# Altium schematic sheet mesh_node.SchDoc
size A3; SheetNumber: 1; SheetTotal: 1
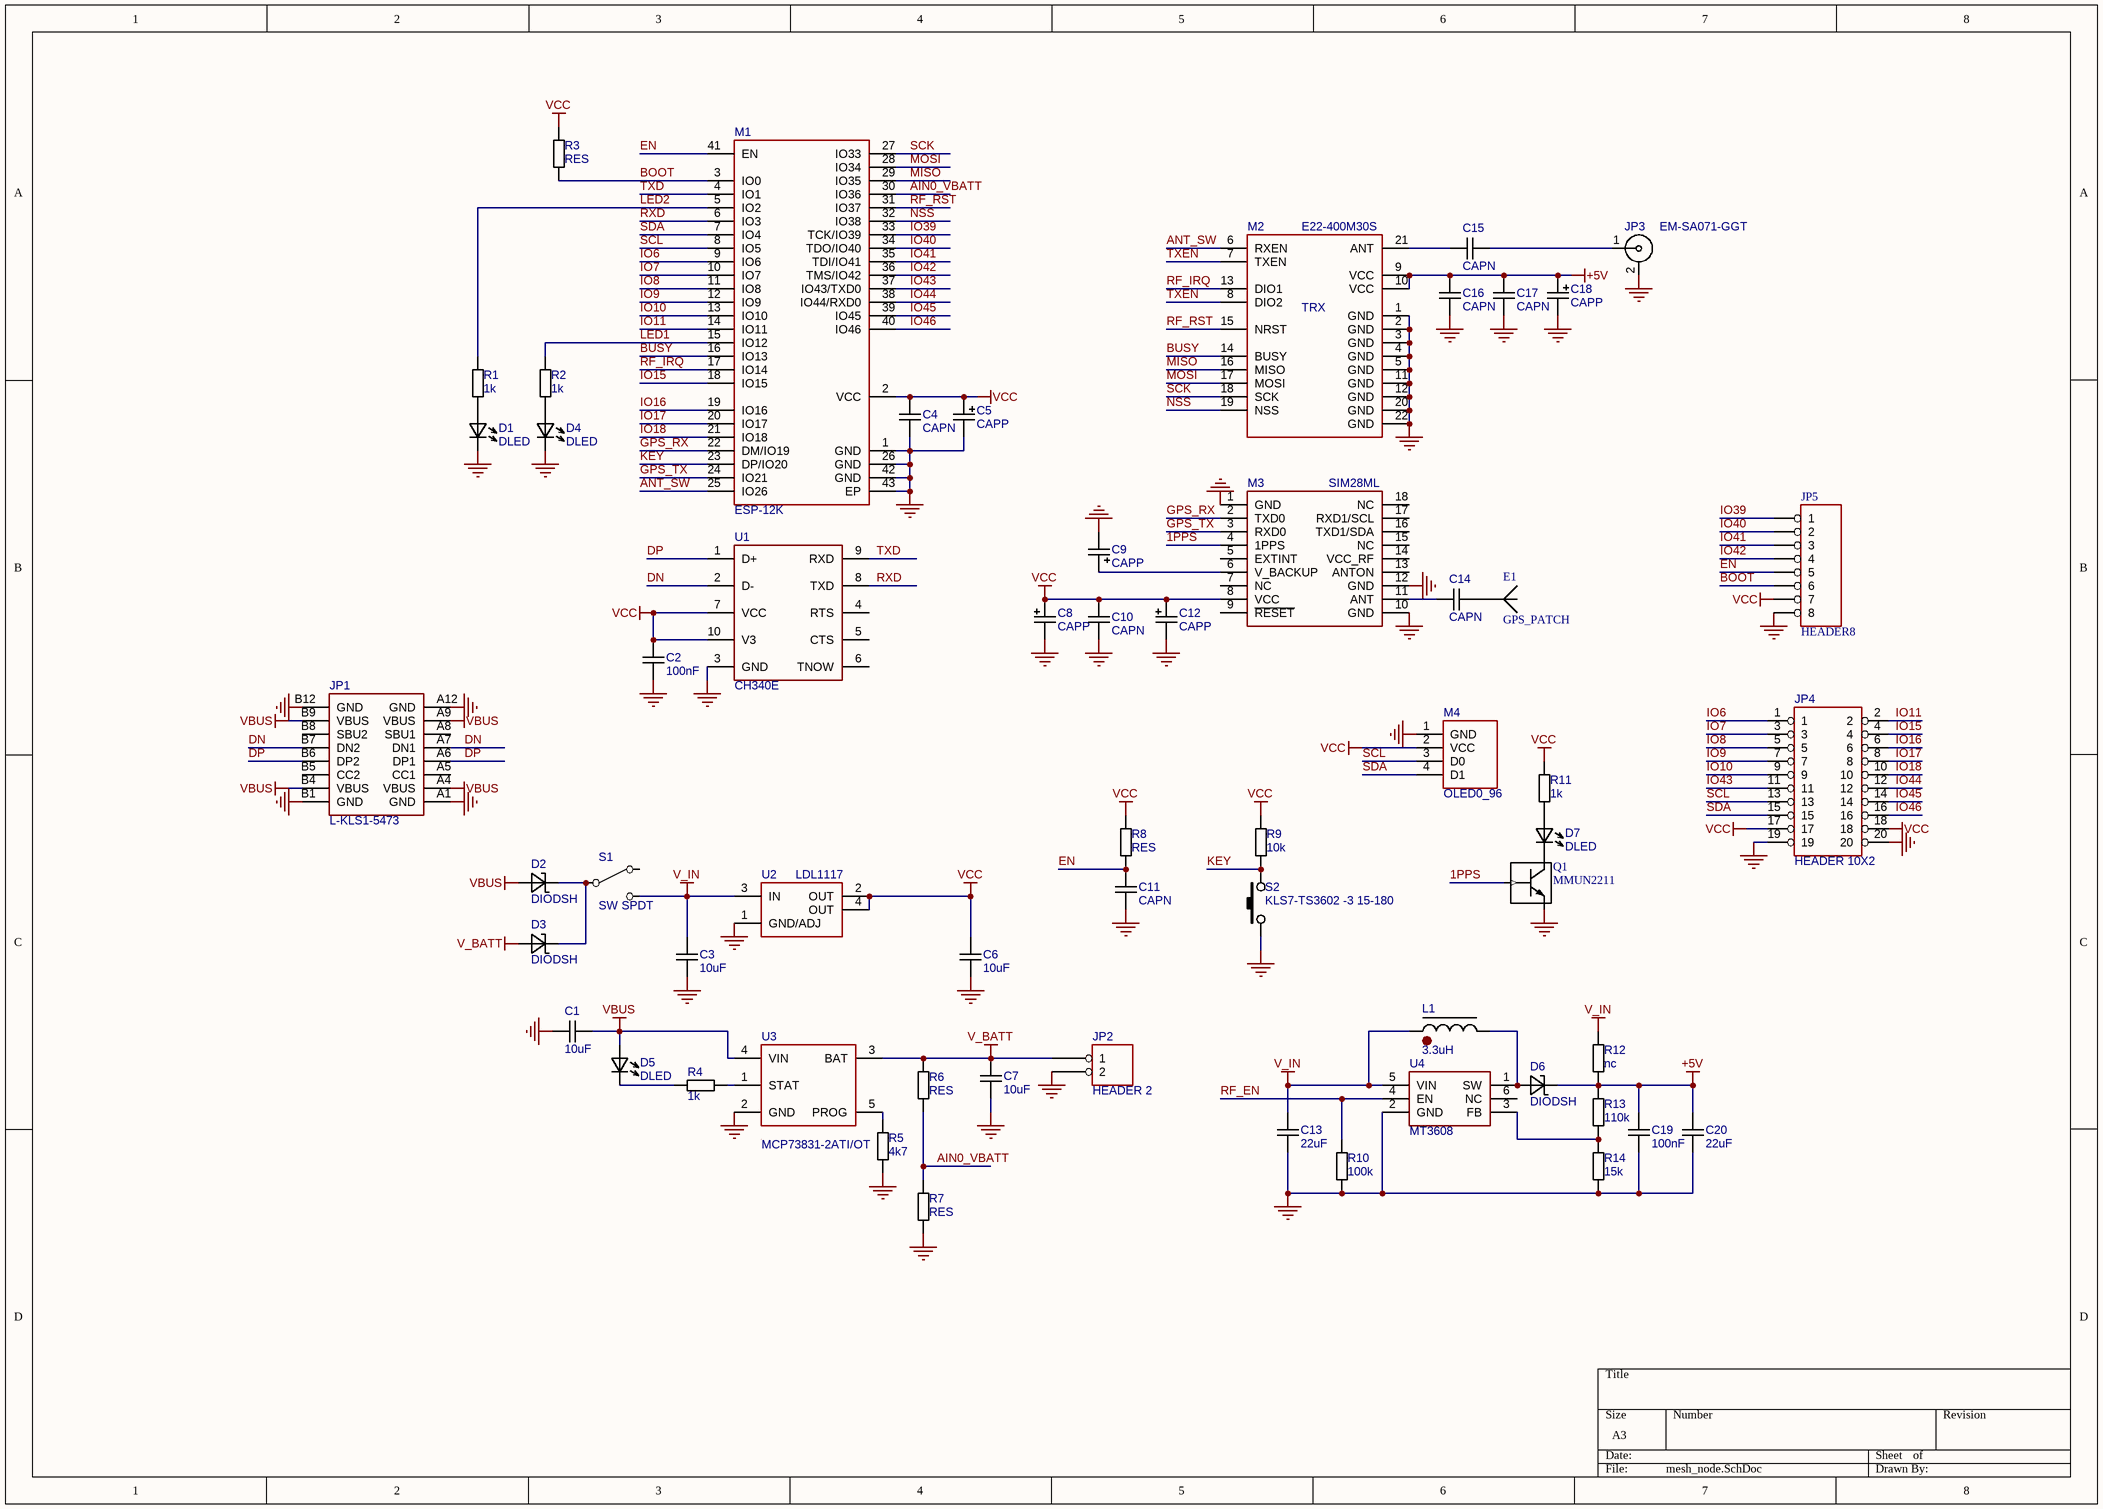
[diagram p0: mesh_node.SchDoc]

## Parts
C1  10uF  [C-0805]
C2  100nF  [C-0603]
C3  10uF  [C-0805]
C4  CAPN  [C-0603]
C5  CAPP  [C_TANTAL_C]
C6  10uF  [C-0805]
C7  10uF  [C-0805]
C8  CAPP  [C_TANTAL_C]
C9  CAPP  [C_TANTAL_C]
C10  CAPN  [C-0603]
C11  CAPN  [C-0603]
C12  CAPP  [C_TANTAL_C]
C13  22uF  [C-0805]
C14  CAPN  [C-0603]
C15  CAPN  [C-0603]
C16  CAPN  [C-0603]
C17  CAPN  [C-0603]
C18  CAPP  [C_TANTAL_C]
C19  100nF  [C-0603]
C20  22uF  [C-0805]
D1  DLED  [LED_3mm_RED]
D2  DIODSH  [D-SMA]
D3  DIODSH  [D-SMA]
D4  DLED  [LED_3mm_RED]
D5  DLED  [LED_3mm_RED]
D6  DIODSH  [D_SMA_NUM]
D7  DLED  [LED_3mm_RED]
E1  GPS_PATCH  [GPSANT_1818]
JP1  L-KLS1-5473  [USB_C_SMD_SLOT]
JP2  HEADER 2  [PLS1-2]
JP3  EM-SA071-GGT  [SMA_F_EDGE]
JP4  HEADER 10X2  [PLS2_10]
JP5  HEADER8  [PLS1-8]
L1  3.3uH  [CDRH6D38]
M1  ESP-12K  [ESP-12K]
M2  E22-400M30S  [PE22(400M30S)]
M3  SIM28ML  [LGA18_GNSS]
M4  OLED0_96  [OLED096_I2C]
Q1  MMUN2211  [SOT-23]
R1  1k  [R-0603]
R2  1k  [R-0603]
R3  RES  [R-0603]
R4  1k  [R-0603]
R5  4k7  [R-0603]
R6  RES  [R-0603]
R7  RES  [R-0603]
R8  RES  [R-0603]
R9  10k  [R-0603]
R10  100k  [R-0603]
R11  1k  [R-0603]
R12  nc  [R-1206]
R13  110k  [R-0603]
R14  15k  [R-0603]
S1  SW SPDT  [SK-12D07VG5]
S2  KLS7-TS3602 -3 15-180  [KLS7-TS3602]
U1  CH340E  [MSOP-10]
U2  LDL1117  [SOT223]
U3  MCP73831-2ATI/OT  [SOT-23-5]
U4  MT3608  [SOT-23-6]

## Nets
+5V: C16.1 C17.1 C18.2 C19.1 C20.1 D6.2 M2.9(VCC) M2.10(VCC) R12.1 R13.2
GND: C1.1 C2.1 C3.2 C4.2 C5.1 C6.2 C7.1 C8.1 C9.1 C10.2 C11.2 C12.1 C13.2 C16.2 C17.2 C18.1 C19.2 C20.2 D1.2 D4.2 JP1.A1(GND) JP1.A12(GND) JP1.B1(GND) JP1.B12(GND) JP2.2 JP3.2 JP4.19 JP4.20 JP5.8 M1.1(GND) M1.26(GND) M1.42(GND) M1.43(EP) M2.1(GND) M2.2(GND) M2.3(GND) M2.4(GND) M2.5(GND) M2.11(GND) M2.12(GND) M2.20(GND) M2.22(GND) M3.1(GND) M3.10(GND) M3.12(GND) M4.1(GND) Q1.2(EMITTER) R5.1 R7.1 R10.1 R14.1 S2.1 U1.3(GND) U2.1(GND/ADJ) U3.2(GND) U4.2(GND)
V_BATT: C7.2 D3.1 JP2.1 R6.2 U3.3(BAT)
V_IN: C3.1 C13.1 L1.1 R12.2 S1.3(NO) U2.3(IN) U4.5(VIN)
VBUS: C1.2 D2.1 D5.1 JP1.A4(VBUS) JP1.A9(VBUS) JP1.B4(VBUS) JP1.B9(VBUS) U3.4(VIN)
VCC: C2.2 C4.1 C5.2 C6.1 C8.2 C10.1 C12.2 JP4.17 JP4.18 JP5.7 M1.2(VCC) M3.8(VCC) M4.2(VCC) R3.2 R8.2 R9.1 R11.2 U1.7(VCC) U1.10(V3) U2.2(OUT) U2.4(OUT)
1PPS: M3.4(1PPS) Q1.1(BASE)
AIN0_VBATT: M1.30(IO36) R6.1 R7.2
ANT_SW: M1.25(IO26) M2.6(RXEN)
BOOT: JP5.6 M1.3(IO0) R3.1
BUSY: M1.16(IO13) M2.14(BUSY)
DN: JP1.A7(DN1) JP1.B7(DN2) U1.2(D-)
DP: JP1.A6(DP1) JP1.B6(DP2) U1.1(D+)
EN: C11.1 JP5.5 M1.41(EN) R8.1
GPS_RX: M1.22(DM/IO19) M3.2(TXD0)
GPS_TX: M1.24(IO21) M3.3(RXD0)
IO6: JP4.1 M1.9(IO6)
IO7: JP4.3 M1.10(IO7)
IO8: JP4.5 M1.11(IO8)
IO9: JP4.7 M1.12(IO9)
IO10: JP4.9 M1.13(IO10)
IO11: JP4.2 M1.14(IO11)
IO15: JP4.4 M1.18(IO15)
IO16: JP4.6 M1.19(IO16)
IO17: JP4.8 M1.20(IO17)
IO18: JP4.10 M1.21(IO18)
IO39: JP5.1 M1.33(TCK/IO39)
IO40: JP5.2 M1.34(TDO/IO40)
IO41: JP5.3 M1.35(TDI/IO41)
IO42: JP5.4 M1.36(TMS/IO42)
IO43: JP4.11 M1.37(IO43/TXD0)
IO44: JP4.12 M1.38(IO44/RXD0)
IO45: JP4.14 M1.39(IO45)
IO46: JP4.16 M1.40(IO46)
KEY: M1.23(DP/IO20) R9.2 S2.2
LED1: M1.15(IO12) R2.2
LED2: M1.5(IO2) R1.2
MISO: M1.29(IO35) M2.16(MISO)
MOSI: M1.28(IO34) M2.17(MOSI)
NSS: M1.32(IO38) M2.19(NSS)
RF_EN: R10.2 U4.4(EN)
RF_IRQ: M1.17(IO14) M2.13(DIO1)
RF_RST: M1.31(IO37) M2.15(NRST)
RXD: M1.6(IO3) U1.8(TXD)
SCK: M1.27(IO33) M2.18(SCK)
SCL: JP4.13 M1.8(IO5) M4.3(D0)
SDA: JP4.15 M1.7(IO4) M4.4(D1)
TXD: M1.4(IO1) U1.9(RXD)
TXEN: M2.7(TXEN) M2.8(DIO2)
NetC9_2: C9.2 M3.6(V_BACKUP)
NetC14_1: C14.1 M3.11(ANT)
NetC14_2: C14.2 E1.1
NetC15_1: C15.1 M2.21(ANT)
NetC15_2: C15.2 JP3.1
NetD1_1: D1.1 R1.1
NetD2_2: D2.2 D3.2 S1.2(COMMON)
NetD4_1: D4.1 R2.1
NetD5_2: D5.2 R4.2
NetD6_1: D6.1 L1.2 U4.1(SW)
NetD7_1: D7.1 R11.1
NetD7_2: D7.2 Q1.3(COLLECTOR)
NetR4_1: R4.1 U3.1(STAT)
NetR5_2: R5.2 U3.5(PROG)
NetR13_1: R13.1 R14.2 U4.3(FB)

Not connected (* = marked no-connect by the designer): JP1 17(VSS) A5(CC1) A8(SBU1) B5(CC2) B8(SBU2); M3 5(EXTINT) 7(NC) 9(~{RESET}) 13(ANTON) 14(VCC_RF) 15(NC) 16(TXD1/SDA) 17(RXD1/SCL) 18(NC); S1 1(NC); U1 4(RTS) 5(CTS) 6(TNOW); U4 6(NC)

## Notes on the sheet
- (in symbol E22) TRX

## Library data of the parts
C1-C4 C6 C7 C10 C11 C13-C17 C19 C20 = CAPN: Voltage: 50V; Точність/група: NP0; Вид: Конденсатор
C5 C8 C9 C12 C18 = CAPP: Voltage: 16V; Вид: Конденсатор
D1 D4 D5 D7 = DLED: Вид: Світлодіод
D2 D3 D6 = DIODSH: Вид: Діод
E1 = ANT: Примітки: Пряма; Вид: Антена
JP1 = L-KLS1-5473: Mounting  Method: SMD; Value: *
JP2 = HEADER 2: Вид: Роз'єм; *: *
JP3 = SMA: SMA Female R/A PCB Mount; Вид: Роз'єм
JP4 = HEADER 10X2: Вид: Роз'єм; *: *
JP5 = HEADER8: Вид: Роз'єм; *: *
L1 = L*: Вид: Індуктивність
M2 = E22
M3 = SIM28ML: Вид: Модуль
M4 = OLED0_96_I2C
Q1 = MMUN2211: Вид: Транзистор
R1-R14 = RES: Точність/група: 5%; Вид: Резистор
S1 = SW SPDT: Вид: Перемикач; Виробник: *; *: *
S2 = SW-1: Вид: Кнопка; Робоча напруга: *
U1 = CH340E: Value: {Value}; Mounting  Method: SMD
U2 = LDL1117: LOW CURRENT ADJUSTABLE  VOLTAGE REGULATOR; Вид: Мікросхема
U3 = MCP73831-2ATI/OT: Library Part: IC`s.SchLib; Manufacturer: Texas Instruments; Man#Part Num#: TPS61023DRLT; Value: {Value}; Mounting  Method: SMD; IC Type: PMIC; Part Number: MCP73831-2ATI/OT; Footprint Part: IC-package.PcbLib; Package: SOT-563; Part Type: IC; Component Type: SMD; Temperature Range: -40°C ~ 125°C (TJ); URL: https://www.ti.com/general/docs/suppproductinfo.tsp?distId=10&gotoUrl=https%3A%2F%2Fwww.ti.com%2Flit%2Fgpn%2Ftps61023; Suplier 1: https://www.digikey.com.au/en/products/detail/texas-instruments/TPS61023DRLT/11310622?s=N4IgTCBcDaICoAUDKA2AjABjAZgCICUAZOEAXQF8g